# EAGLE schematic Anthophora (EAGLE 9.5.2)
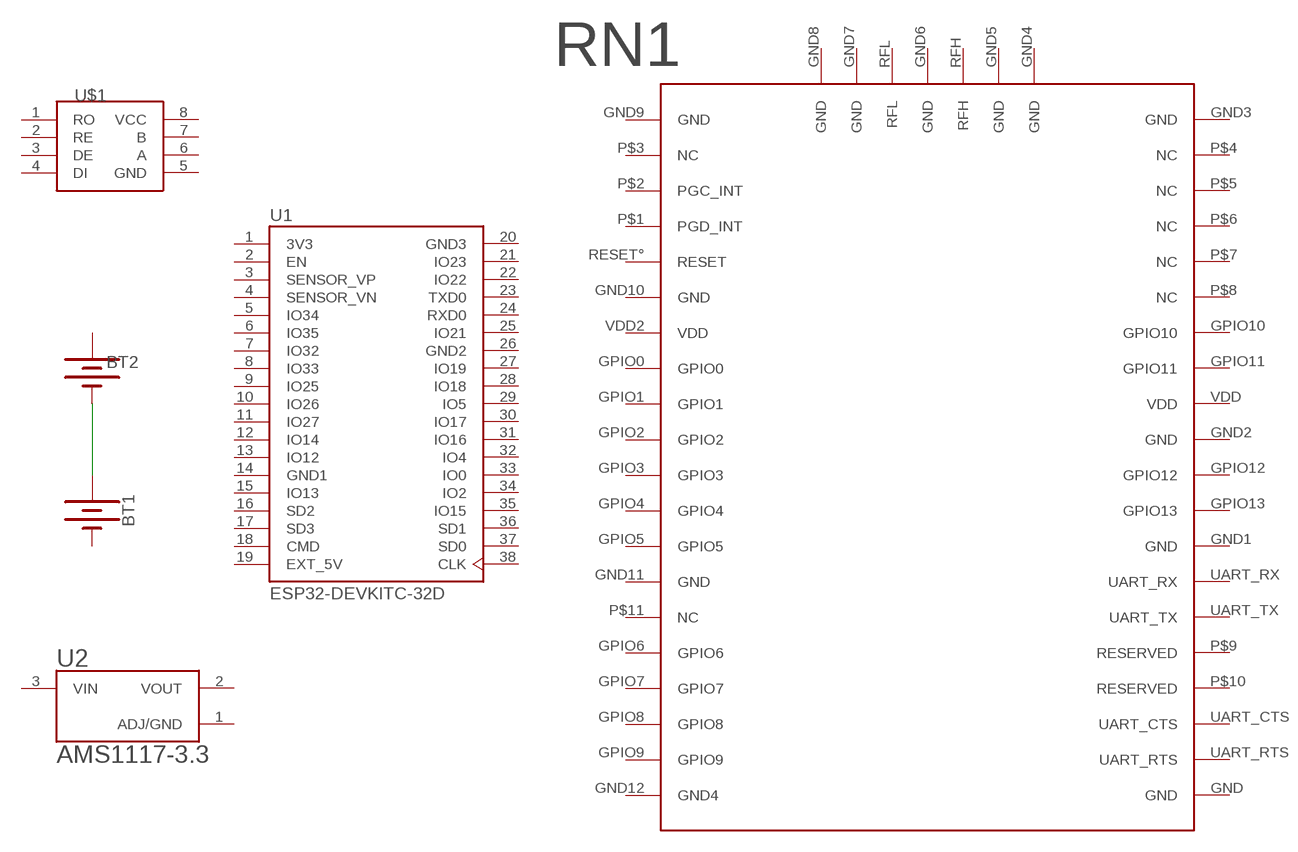
[diagram p0: schematic, sheet 1]

## Parts
BT1  BATTERY-AA_KIT  [BATTERY-AA-KIT]
BT2  BATTERY-AA_KIT  [BATTERY-AA-KIT]
RN1  NEW_RN2483  [NEW_RN2483]
U1  ESP32-DEVKITC-32D  [MODULE_ESP32-DEVKITC-32D]
U2  AMS1117-3.3  [SOT229P700X180-4N]
U$1  AMD3485E  [AMD3485E]

## Nets
N$1: BT1.PWR@1(+) BT2.GND@1(-)
Unconnected: RN1.GND RN1.GND1(GND) RN1.GND2(GND) RN1.GND3(GND) RN1.GND4(GND) RN1.GND5(GND) RN1.GND6(GND) RN1.GND7(GND) RN1.GND8(GND) RN1.GND9(GND) RN1.GND10(GND) RN1.GND11(GND) RN1.GND12(GND4) RN1.GPIO0 RN1.GPIO1 RN1.GPIO2 RN1.GPIO3 RN1.GPIO4 RN1.GPIO5 RN1.GPIO6 RN1.GPIO7 RN1.GPIO8 RN1.GPIO9 RN1.GPIO10 RN1.GPIO11 RN1.GPIO12 RN1.GPIO13 RN1.P$1(PGD_INT) RN1.P$2(PGC_INT) RN1.P$3(NC) RN1.P$4(NC) RN1.P$5(NC) RN1.P$6(NC) RN1.P$7(NC) RN1.P$8(NC) RN1.P$9(RESERVED) RN1.P$10(RESERVED) RN1.P$11(NC) RN1.RESET°(RESET) RN1.RFH RN1.RFL RN1.UART_CTS RN1.UART_RTS RN1.UART_RX RN1.UART_TX RN1.VDD RN1.VDD2(VDD) U1.2(EN) U1.3(SENSOR_VP) U1.4(SENSOR_VN) U1.5(IO34) U1.6(IO35) U1.7(IO32) U1.8(IO33) U1.9(IO25) U1.10(IO26) U1.11(IO27) U1.12(IO14) U1.13(IO12) U1.15(IO13) U1.16(SD2) U1.17(SD3) U1.18(CMD) U1.21(IO23) U1.22(IO22) U1.23(TXD0) U1.24(RXD0) U1.25(IO21) U1.27(IO19) U1.28(IO18) U1.29(IO5) U1.30(IO17) U1.31(IO16) U1.32(IO4) U1.33(IO0) U1.34(IO2) U1.35(IO15) U1.36(SD1) U1.37(SD0) U1.38(CLK) U2.2(VOUT) U2.3(VIN) U$1.1(RO) U$1.2(RE) U$1.3(DE) U$1.4(DI) U$1.5(GND) U$1.6(A) U$1.7(B) U$1.8(VCC)

## Power pins joined to a net without a drawn wire
3V3: U1.1(3V3)
+: BT2.PWR@1(+)
-: BT1.GND@1(-)
ADJ/GND: U2.1(ADJ/GND)
EXT_5V: U1.19(EXT_5V)
GND1: U1.14(GND1)
GND2: U1.26(GND2)
GND3: U1.20(GND3)

## Library data of the parts
BT1 BT2 = SparkFun-Batteries:BATTERY: Battery - Single Cell A variety of battery chemistries, sizes, and footprints. Device List: 20MM_PTH - Coin Cell Battery Holder - 20mm (PTH) <https://www.sparkfun.com/products/783> 20MM_PTH_KIT- Coin Cell battery Holder - 20 mm (PTH) <http://www.sparkfun.com/products/783>kit version with special mask 6.8MM_PTH - Coin Cell Battery Holder - 6.8MM(SMD) <https://www.digikey.com/product-detail/en/seiko-instruments/MS621FE-FL11E/728-1057-ND/1889208?WT.srch=1&gclid=CNOQ5a6LzdQCFZS2wAodXCkE0g> 12MM_SMD - Coin Cell Battery Holder - 12mm (SMD) <https://www.sparkfun.com/products/10592> 12MM_PTH - Coin Cell Battery Holder - 12mm (PTH) <https://www.sparkfun.com/products/7948> 20MM_SMD - 20mm Coin Cell Battery Holder (SMD) (2 legs) Used on the Big Time Watch Kit <https://www.sparkfun.com/products/11734> 20MM_SMD_4LEGS - Coin Cell Battery Holder - 20mm (SMD) <https://www.sparkfun.com/products/11892> 20MM_SMD_4LEGS_OVERPASTE - Coin Cell Battery Holder - 20mm (SMD) <https://www.sparkfun.com/products/11892> (Over-paste on the legs) 24.5MM_PTH - Coin Cell Battery Holder - 24.5mm (PTH) <https://www.sparkfun.com/products/8863> 9V - 9V Battery Holder - PC Mount Used on the SparkFun SparkPunk Sound Kit <https://www.sparkfun.com/products/11177> and SparkFun SparkPunk Sequencer Kit <https://www.sparkfun.com/products/12707> 18650 - Battery Holder - 18650 (PTH) <https://www.sparkfun.com/products/13113> AA - Battery Holder - 1xAA (PTH) <https://www.sparkfun.com/products/7949> AAA - Battery Holder - 1xAAA (PTH) <https://www.sparkfun.com/products/12718> AA_KIT - Battery Holder - 1xAA (PTH) <https://www.sparkfun.com/products/7949> Special kit package - pads only have exposed copper on one side of the board. AAA_KIT - Battery Holder - 1xAAA (PTH) <https://www.sparkfun.com/products/12718> Special kit package - pads only have exposed copper on one side of the board.; PROD_ID: BATT-08316; SF_SKU: PRT-07949
RN1 = tobias:NEW_RN2483
U1 = ESP32-DEVKITC-32D (1):ESP32-DEVKITC-32D: Eval Board For Esp-Wroom-32; AVAILABILITY: Unavailable; DESCRIPTION: - Transceiver; 802.11 b/g/n (Wi-Fi, WiFi, WLAN), Bluetooth® Smart Ready 4.x Dual Mode For Use With ESP-WROOM-32; MF: Espressif Systems; MP: ESP32-DEVKITC-32D; PACKAGE: None; PRICE: None
U2 = AMS1117-3.3:AMS1117-3.3: Sot223/Pkg 1-Amp 3.3-Volt Low Drop Out Voltage Regulatator; AVAILABILITY: Unavailable; DESCRIPTION: Sot223/Pkg 1-Amp 3.3-Volt Low Drop Out Voltage Regulatator; MF: Advanced Monolithic Systems; MP: AMS1117-3.3; PACKAGE: None; PRICE: None
U$1 = AMD3485E:AMD3485E